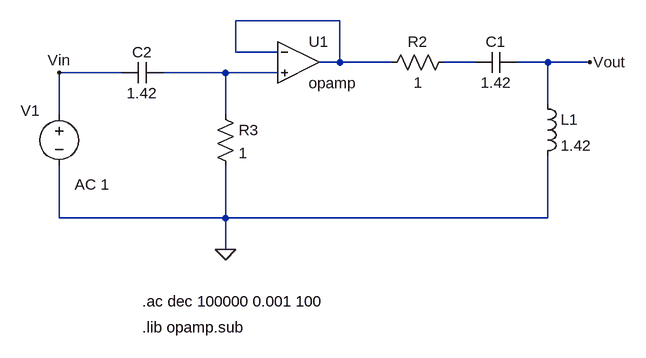
[diagram p0: schematic circuito_norm.asc]
circuito_norm.asc, the LTspice schematic file:
Version 4
SHEET 1 932 964
WIRE 32 128 -128 128
WIRE -128 176 -128 128
WIRE -64 176 -128 176
WIRE 32 192 32 128
WIRE 32 192 0 192
WIRE 112 192 32 192
WIRE 240 192 192 192
WIRE 352 192 304 192
WIRE 416 192 352 192
WIRE -304 208 -400 208
WIRE -144 208 -240 208
WIRE -64 208 -144 208
WIRE 352 256 352 192
WIRE -400 272 -400 208
WIRE -144 272 -144 208
WIRE -400 432 -400 352
WIRE -144 432 -144 352
WIRE -144 432 -400 432
WIRE 352 432 352 336
WIRE 352 432 -144 432
WIRE -144 480 -144 432
FLAG -400 208 Vin
FLAG 416 192 Vout
FLAG -144 480 0
SYMBOL voltage -400 256 R0
WINDOW 123 24 124 Left 2
WINDOW 39 0 0 Left 0
WINDOW 0 -59 10 Left 2
SYMATTR Value2 AC 1
SYMATTR InstName V1
SYMATTR Value ""
SYMBOL OpAmps\\opamp -32 128 R0
SYMATTR InstName U1
SYMBOL res 208 176 R90
WINDOW 0 0 56 VBottom 2
WINDOW 3 32 56 VTop 2
SYMATTR InstName R2
SYMATTR Value 1
SYMBOL cap 304 176 R90
WINDOW 0 0 32 VBottom 2
WINDOW 3 32 32 VTop 2
SYMATTR InstName C1
SYMATTR Value 1.42
SYMBOL res -160 256 R0
SYMATTR InstName R3
SYMATTR Value 1
SYMBOL cap -240 192 R90
WINDOW 0 0 32 VBottom 2
WINDOW 3 32 32 VTop 2
SYMATTR InstName C2
SYMATTR Value 1.42
SYMBOL ind 336 240 R0
SYMATTR InstName L1
SYMATTR Value 1.42
TEXT -272 600 Left 2 !.lib opamp.sub
TEXT -272 560 Left 2 !.ac dec 100000 0.001 100

The netlist it stands for:
* circuito_norm.asc
V1 Vin 0 AC 1
XU1 N001 N003 N001 opamp Aol=100K GBW=10Meg  ; pins invin noninvin out
R2 N002 N001 1
C1 Vout N002 1.42
R3 N003 0 1
C2 N003 Vin 1.42
L1 Vout 0 1.42
.lib opamp.sub
.ac dec 100000 0.001 100
.backanno
.end